# Altium project Rad_hard_git.PrjPcb (part 2 of 2)
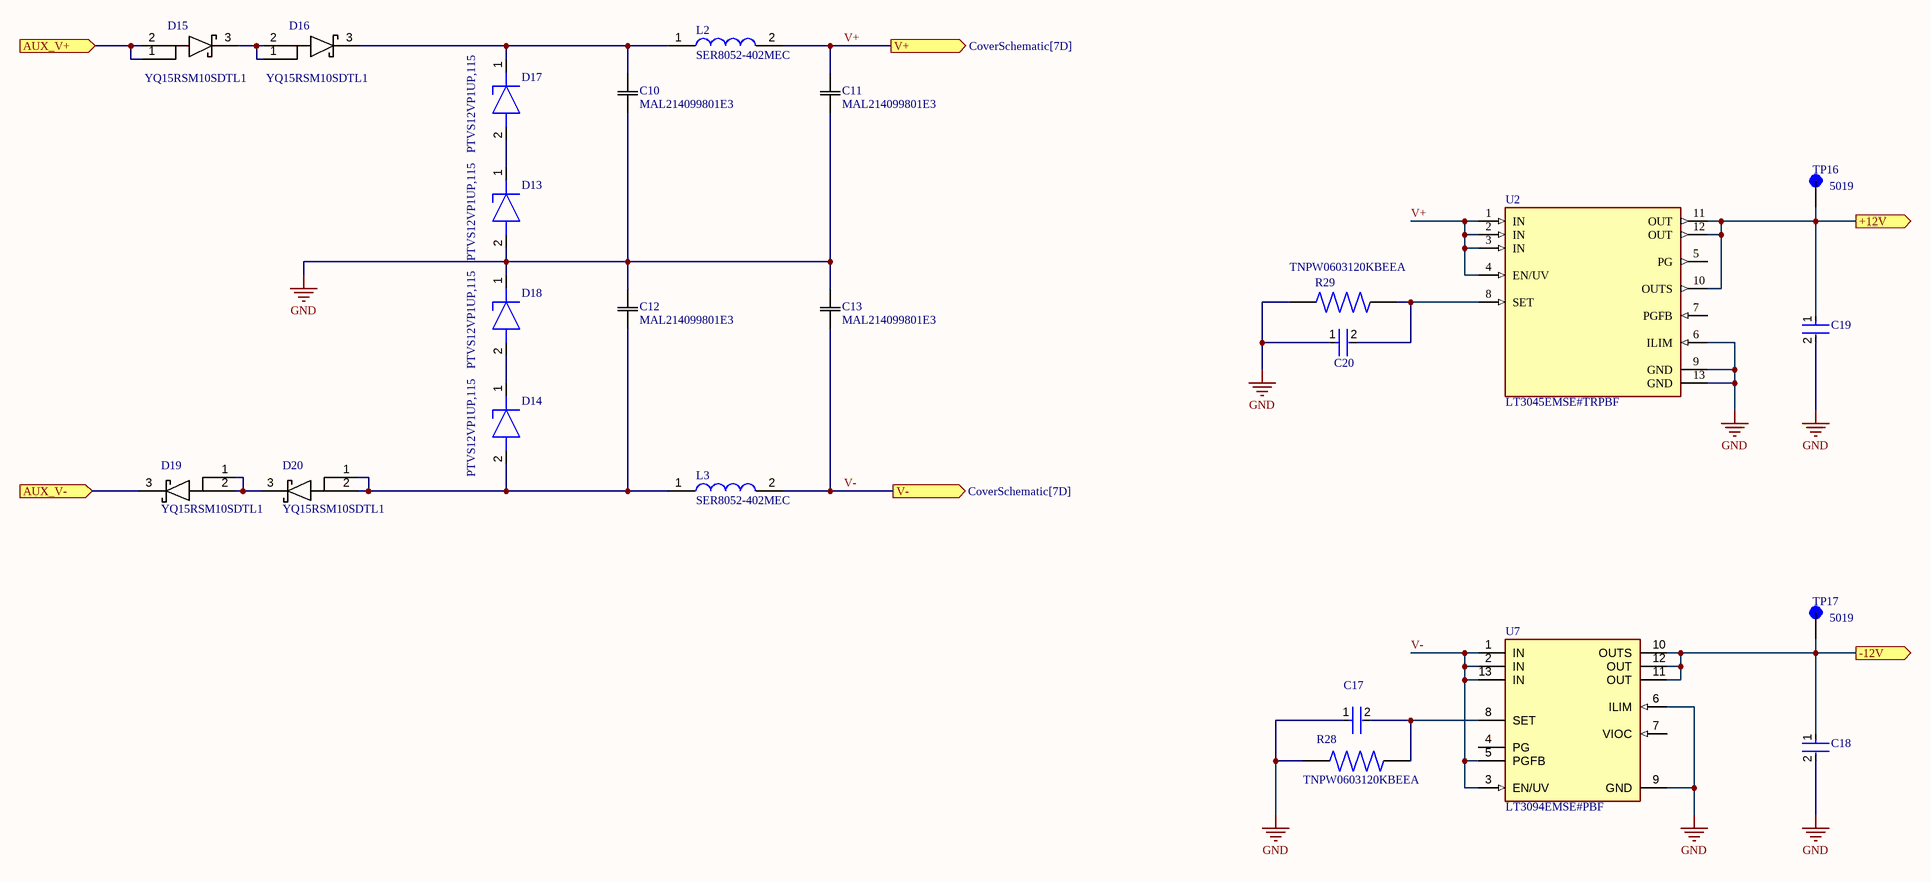
[diagram p9: Lownoise_auxReg.SchDoc]

## Nets that join several sheets
GND: Connector (13 pins), PassElement (6 pins), Reference (10 pins), Temperature_Enhanced_WB1 (14 pins), SolidStateDosimeter (16 pins), TemperatureMon (7 pins), Lownoise_auxReg (17 pins), Temperature_Enhanced_WB2 (14 pins)
NetAmph_5: Connector (Amph.5 J1.1), Reference (R1.6 TP1.TP U4.13 U4.14), Temperature_Enhanced_WB1 (R45_Temperature_Enhanced_WB1.2), Temperature_Enhanced_WB2 (R45_Temperature_Enhanced_WB2.2)
NetAmph_7: Connector (Amph.7 J1.19), Reference (TP2.TP U4.6 U4.7), Temperature_Enhanced_WB1 (R40_Temperature_Enhanced_WB1.2 R46_Temperature_Enhanced_WB1.2), Temperature_Enhanced_WB2 (R40_Temperature_Enhanced_WB2.2 R46_Temperature_Enhanced_WB2.2)
NetC3_2: Connector (J3.5), PassElement (7 pins), Temperature_Enhanced_WB1 (U8_Temperature_Enhanced_WB1.3), Temperature_Enhanced_WB2 (U8_Temperature_Enhanced_WB2.3)
NetC7_2: Reference (C7.2 Q13.3 U4.4), SolidStateDosimeter (FB1.1), TemperatureMon (C15.1 R30.2 R33.3 U9.4), Lownoise_auxReg (5 pins)
NetD1_1: Connector (J1.26), PassElement (6 pins), TemperatureMon (Q14.2)
NetD3_1: Connector (J3.1), PassElement (D3.1 D3.2 TP9.TP)
NetD5_1: PassElement (6 pins), TemperatureMon (Q15.2)
NetD15_1: Connector (J3.7), Lownoise_auxReg (D15.1 D15.2)
NetD19_3: Connector (J3.3), Lownoise_auxReg (D19.3)
NetD27_2: Connector (J3.2), PassElement (D27.2 D28.2 U1.3)
NetJ1_3: Connector (J1.3), Temperature_Enhanced_WB1 (5 pins), Temperature_Enhanced_WB2 (5 pins)
NetJ1_5: Connector (J1.5), Temperature_Enhanced_WB1 (R40_Temperature_Enhanced_WB1.1 U6_Temperature_Enhanced_WB1.13), Temperature_Enhanced_WB2 (R40_Temperature_Enhanced_WB2.1 U6_Temperature_Enhanced_WB2.13)
NetJ1_8: Connector (J1.8), PassElement (R12.1 R17.1)
NetJ1_9: Connector (J1.9), PassElement (R8.1 R15.1)
NetJ1_20: Connector (J1.20), Temperature_Enhanced_WB1 (R50_Temperature_Enhanced_WB1.2 U8_Temperature_Enhanced_WB1.1 U8_Temperature_Enhanced_WB1.16), Temperature_Enhanced_WB2 (R50_Temperature_Enhanced_WB2.2 U8_Temperature_Enhanced_WB2.1 U8_Temperature_Enhanced_WB2.16)
NetJ1_21: Connector (J1.21), Temperature_Enhanced_WB1 (R53_Temperature_Enhanced_WB1.2 U8_Temperature_Enhanced_WB1.9), Temperature_Enhanced_WB2 (R53_Temperature_Enhanced_WB2.2 U8_Temperature_Enhanced_WB2.9)
NetJ1_22: Connector (J1.22), Temperature_Enhanced_WB1 (R54_Temperature_Enhanced_WB1.2 U8_Temperature_Enhanced_WB1.8), Temperature_Enhanced_WB2 (R54_Temperature_Enhanced_WB2.2 U8_Temperature_Enhanced_WB2.8)
NetJ1_24: Connector (J1.24), SolidStateDosimeter (R16.2 TP11.TP)
NetJ1_25: Connector (J1.25), TemperatureMon (U9.6 U9.7)
NetQ1_3: PassElement (6 pins), Temperature_Enhanced_WB2 (R36_Temperature_Enhanced_WB2.1)
NetQ5_4: PassElement (Q5.4 R3.2), Temperature_Enhanced_WB2 (R37_Temperature_Enhanced_WB2.1)
NetQ6_3: PassElement (6 pins), Temperature_Enhanced_WB1 (R36_Temperature_Enhanced_WB1.1)
NetQ7_4: PassElement (Q7.4 R9.2), Temperature_Enhanced_WB1 (R37_Temperature_Enhanced_WB1.1)
NetR5_1: PassElement (R5.1), Temperature_Enhanced_WB2 (U6_Temperature_Enhanced_WB2.14)
NetR6_2: PassElement (R6.2), Temperature_Enhanced_WB2 (U6_Temperature_Enhanced_WB2.8)
NetR13_1: PassElement (R13.1), Temperature_Enhanced_WB1 (U6_Temperature_Enhanced_WB1.14)
NetR14_2: PassElement (R14.2), Temperature_Enhanced_WB1 (U6_Temperature_Enhanced_WB1.8)
Sense+: Connector (J3.4), Temperature_Enhanced_WB1 (D24_Temperature_Enhanced_WB1.2 D26_Temperature_Enhanced_WB1.1 R41_Temperature_Enhanced_WB1.2 U8_Temperature_Enhanced_WB1.2), Temperature_Enhanced_WB2 (D24_Temperature_Enhanced_WB2.2 D26_Temperature_Enhanced_WB2.1 R41_Temperature_Enhanced_WB2.2 U8_Temperature_Enhanced_WB2.2)
Sense-: Connector (J3.8), Temperature_Enhanced_WB1 (D23_Temperature_Enhanced_WB1.2 D25_Temperature_Enhanced_WB1.1 R43_Temperature_Enhanced_WB1.2 U8_Temperature_Enhanced_WB1.14), Temperature_Enhanced_WB2 (D23_Temperature_Enhanced_WB2.2 D25_Temperature_Enhanced_WB2.1 R43_Temperature_Enhanced_WB2.2 U8_Temperature_Enhanced_WB2.14)
V+: PassElement (C2.2 F1.1 F3.1 L1.2), Temperature_Enhanced_WB1 (8 pins), Temperature_Enhanced_WB2 (8 pins)
V-: PassElement (8 pins), Temperature_Enhanced_WB1 (C22_Temperature_Enhanced_WB1.1 U6_Temperature_Enhanced_WB1.11), SolidStateDosimeter (FB2.2), TemperatureMon (C16.1 Q14.3 Q15.3 U9.11), Lownoise_auxReg (5 pins), Temperature_Enhanced_WB2 (C22_Temperature_Enhanced_WB2.1 U6_Temperature_Enhanced_WB2.11)

## Assembly variants
Variant of Rad_hard_git: not fitted C21_Temperature_Enhanced_WB1 C22_Temperature_Enhanced_WB1 C23_Temperature_Enhanced_WB1 D5 D6 D23_Temperature_Enhanced_WB1 D24_Temperature_Enhanced_WB1 D25_Temperature_Enhanced_WB1 D26_Temperature_Enhanced_WB1 F3 Q6 Q7 Q9 Q10 Q11 Q12 R9 R10 R11 R12 R13 R14 R17 R36_Temperature_Enhanced_WB1 R37_Temperature_Enhanced_WB1 R38_Temperature_Enhanced_WB1 R39_Temperature_Enhanced_WB1 R40_Temperature_Enhanced_WB1 R41_Temperature_Enhanced_WB1 R42_Temperature_Enhanced_WB1 R43_Temperature_Enhanced_WB1 R44_Temperature_Enhanced_WB1 R45_Temperature_Enhanced_WB1 R46_Temperature_Enhanced_WB1 R47_Temperature_Enhanced_WB1 R48_Temperature_Enhanced_WB1 R49_Temperature_Enhanced_WB1 R50_Temperature_Enhanced_WB1 R51_Temperature_Enhanced_WB1 R52_Temperature_Enhanced_WB1 R53_Temperature_Enhanced_WB1 R54_Temperature_Enhanced_WB1 U6_Temperature_Enhanced_WB1 U8_Temperature_Enhanced_WB1